# Altium schematic sheet Power.SchDoc
size A; SheetNumber: roneV11-Power; SheetTotal: 6
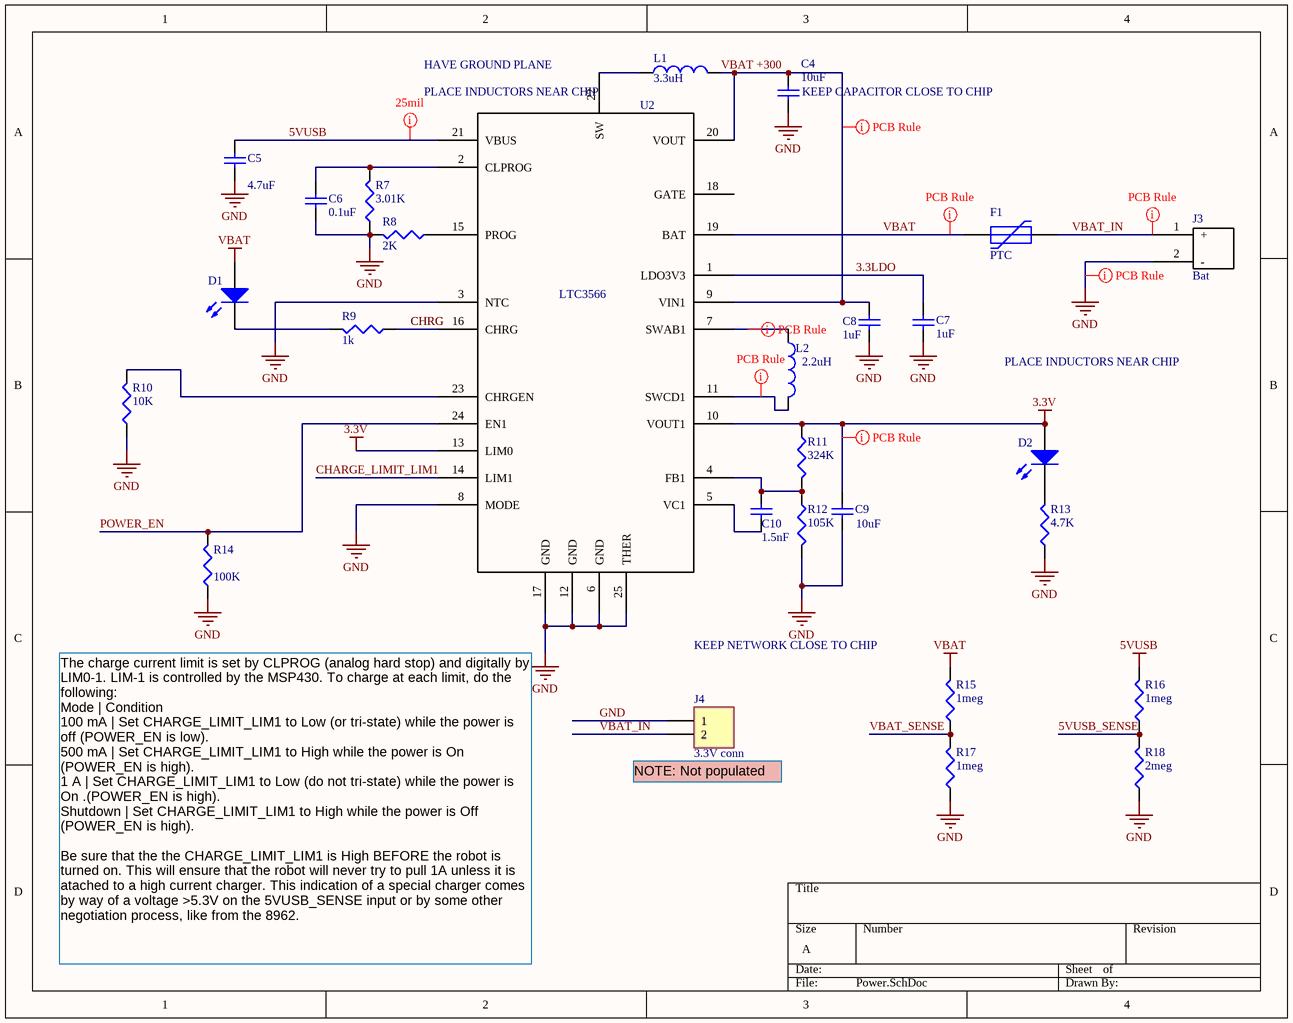
[diagram p0: Power.SchDoc]

## Parts
C4  value 10uF  [CAPC1608L]  (hidden comment: Cap)
C5  value 4.7uF  [CAPC1608L]  (hidden comment: Cap Semi)
C6  value 0.1uF  [CAPC1005L]  (hidden comment: Cap)
C7  value 1uF  [CAPC1608L]  (hidden comment: Cap)
C8  value 1uF  [CAPC1608L]  (hidden comment: Cap)
C9  value 10uF  [CAPC1608L]  (hidden comment: Cap)
C10  value 1.5nF  [CAPC1005L]  (hidden comment: Cap)
D1  Charge  [INDC2012L]  (value not drawn)
D2  Power  [INDC2012L]  (value not drawn)
F1  PTC  [ERJ8G-1206]
J3  Bat  [BatteryConnJST]
J4  3.3V conn  [HDR1X2]
L1  3.3uH  [IndPow]
L2  2.2uH  [IndPow]
R7  value 3.01K  [RESC1608L]  (hidden comment: Res3)
R8  value 2K  [RESC1608L]  (hidden comment: Res3)
R9  value 1k  [RESC1608L]  (hidden comment: Res3)
R10  value 10K  [RESC1608L]  (hidden comment: Res3)
R11  value 324K  [RESC1608L]  (hidden comment: Res3)
R12  value 105K  [RESC1608L]  (hidden comment: Res3)
R13  value 4.7K  [RESC1608L]  (hidden comment: Res3)
R14  value 100K  [RESC1608L]  (hidden comment: Res3)
R15  value 1meg  [RESC1608L]  (hidden comment: Res3)
R16  value 1meg  [RESC1608L]  (hidden comment: Res3)
R17  value 1meg  [RESC1608L]  (hidden comment: Res3)
R18  value 2meg  [RESC1608L]  (hidden comment: Res3)
U2  LTC3566  [QFN-24]

## Nets
3.3V: C9.2 D2.1(A) R11.1 U2.10(VOUT1) U2.13(LIM0)
5VUSB: C5.2 R16.2 U2.21(VBUS)
GND: C4.1 C5.1 C6.1 C7.2 C8.2 C9.1 J3.2(-) J4.1 R7.1 R8.2 R10.1 R12.2 R13.1 R14.1 R17.1 R18.1 U2.3(NTC) U2.6(GND) U2.8(MODE) U2.12(GND) U2.17(GND) U2.25(THER)
VBAT: D1.1(A) F1.1 R15.2 U2.19(BAT)
3.3LDO: C7.1 U2.1(LDO3V3)
5VUSB_SENSE: R16.1 R18.2
CHARGE_LIMIT_LIM1: U2.14(LIM1)
CHRG: R9.1 U2.16(CHRG)
POWER_EN: R14.2 U2.24(EN1)
VBAT +300: C4.2 C8.1 L1.2 U2.9(VIN1) U2.20(VOUT)
VBAT_IN: F1.2 J3.1(+) J4.2
VBAT_SENSE: R15.1 R17.2
NetC6_2: C6.2 R7.2 U2.2(CLPROG)
NetC10_1: C10.1 R11.2 R12.1 U2.4(FB1)
NetC10_2: C10.2 U2.5(VC1)
NetD1_2: D1.2(K) R9.2
NetD2_2: D2.2(K) R13.2
NetL1_1: L1.1 U2.22(SW)
NetL2_1: L2.1 U2.7(SWAB1)
NetL2_2: L2.2 U2.11(SWCD1)
NetR8_1: R8.1 U2.15(PROG)
NetR10_2: R10.2 U2.23(CHRGEN)

Not connected (* = marked no-connect by the designer): U2 18(GATE)

## Layout directives
rule Width Constraint [Pref Width = 25mil    Min Width = 10mil    Max Width = 25mil]: 5VUSB, GND, NetL2_1, NetL2_2, VBAT +300, VBAT_IN
rule Width Constraint [Pref Width = 25mil    Min Width = 10mil    Max Width = 100mil]: 3.3V
rule Width Constraint [Pref Width = 25mil    Min Width = 10mil    Max Width = 50mil]: VBAT

## Notes on the sheet
- (near U2) HAVE GROUND PLANE
- (near U2) PLACE INDUCTORS NEAR CHIP
- (near C4) KEEP CAPACITOR CLOSE TO CHIP
- CHRG
- PLACE INDUCTORS NEAR CHIP
- KEEP NETWORK CLOSE TO CHIP
- (near J4) NOTE: Not populated
- The charge current limit is set by CLPROG (analog hard stop) and digitally by LIM0-1. LIM-1 is controlled by the MSP430. To charge at each limit, do the following:
  Mode	| Condition
  100 mA	| Set CHARGE_LIMIT_LIM1 to Low (or tri-state) while the power is off (POWER_EN is low).
  500 mA	| Set CHARGE_LIMIT_LIM1 to High while the power is On (POWER_EN is high).
  1 A	| Set CHARGE_LIMIT_LIM1 to Low (do not tri-state) while the power is On .(POWER_EN is high).
  Shutdown | Set CHARGE_LIMIT_LIM1 to High while the power is Off (POWER_EN is high).
  Be sure that the the CHARGE_LIMIT_LIM1 is High BEFORE the robot is turned on. This will ensure that the robot will never try to pull 1A unless it is atached to a high current charger. This indication of a special charger comes by way of a voltage >5.3V on the 5VUSB_SENSE input or by some other negotiation process, like from the 8962.

## Library data of the parts
C4 C6-C10 = Cap: Capacitor; Published: 8-Jun-2000; LatestRevisionDate: 17-Jul-2002; LatestRevisionNote: Re-released for DXP Platform.; PackageReference: RAD-0.3; Publisher: Altium Limited
C5 = Cap Semi: Capacitor (Semiconductor SIM Model); Published: 8-Jun-2000; LatestRevisionDate: 29-May-2009; LatestRevisionNote: IPC-7351 Footprint Added.; PackageReference: C1206; Publisher: Altium Limited; PackageDescription: Chip Capacitor
D1 D2 = LED2: Typical RED, GREEN, YELLOW, AMBER GaAs LED; Published: 8-Jun-2000; LatestRevisionDate: 17-Jul-2002; LatestRevisionNote: Re-released for DXP Platform.; PackageVersion: Feb-2002; PackageReference: 3.2X1.6X1.1; Publisher: Altium Limited
F1 = PTC_FUSE: Fuse; Published: 8-Jun-2000; LatestRevisionDate: 17-Jul-2002; LatestRevisionNote: Re-released for DXP Platform.; PackageReference: PIN-W2/E2.8; Publisher: Altium Limited
J3 = BatteryConnJST
J4 = Header 2: Header, 2-Pin; LatestRevisionDate: 17-Jul-2002; LatestRevisionNote: Re-released for DXP Platform.; Publisher: Altium Limited
L1 L2 = Inductor
  L1: Value: 3.3uH
  L2: Value: 2.2uH
R7-R18 = Res3: Resistor; Published: 8-Jun-2000; LatestRevisionDate: 29-May-2009; LatestRevisionNote: IPC-7351 Footprint Added.; PackageReference: J1-0603; Publisher: Altium Limited; PackageDescription: Chip Resistor